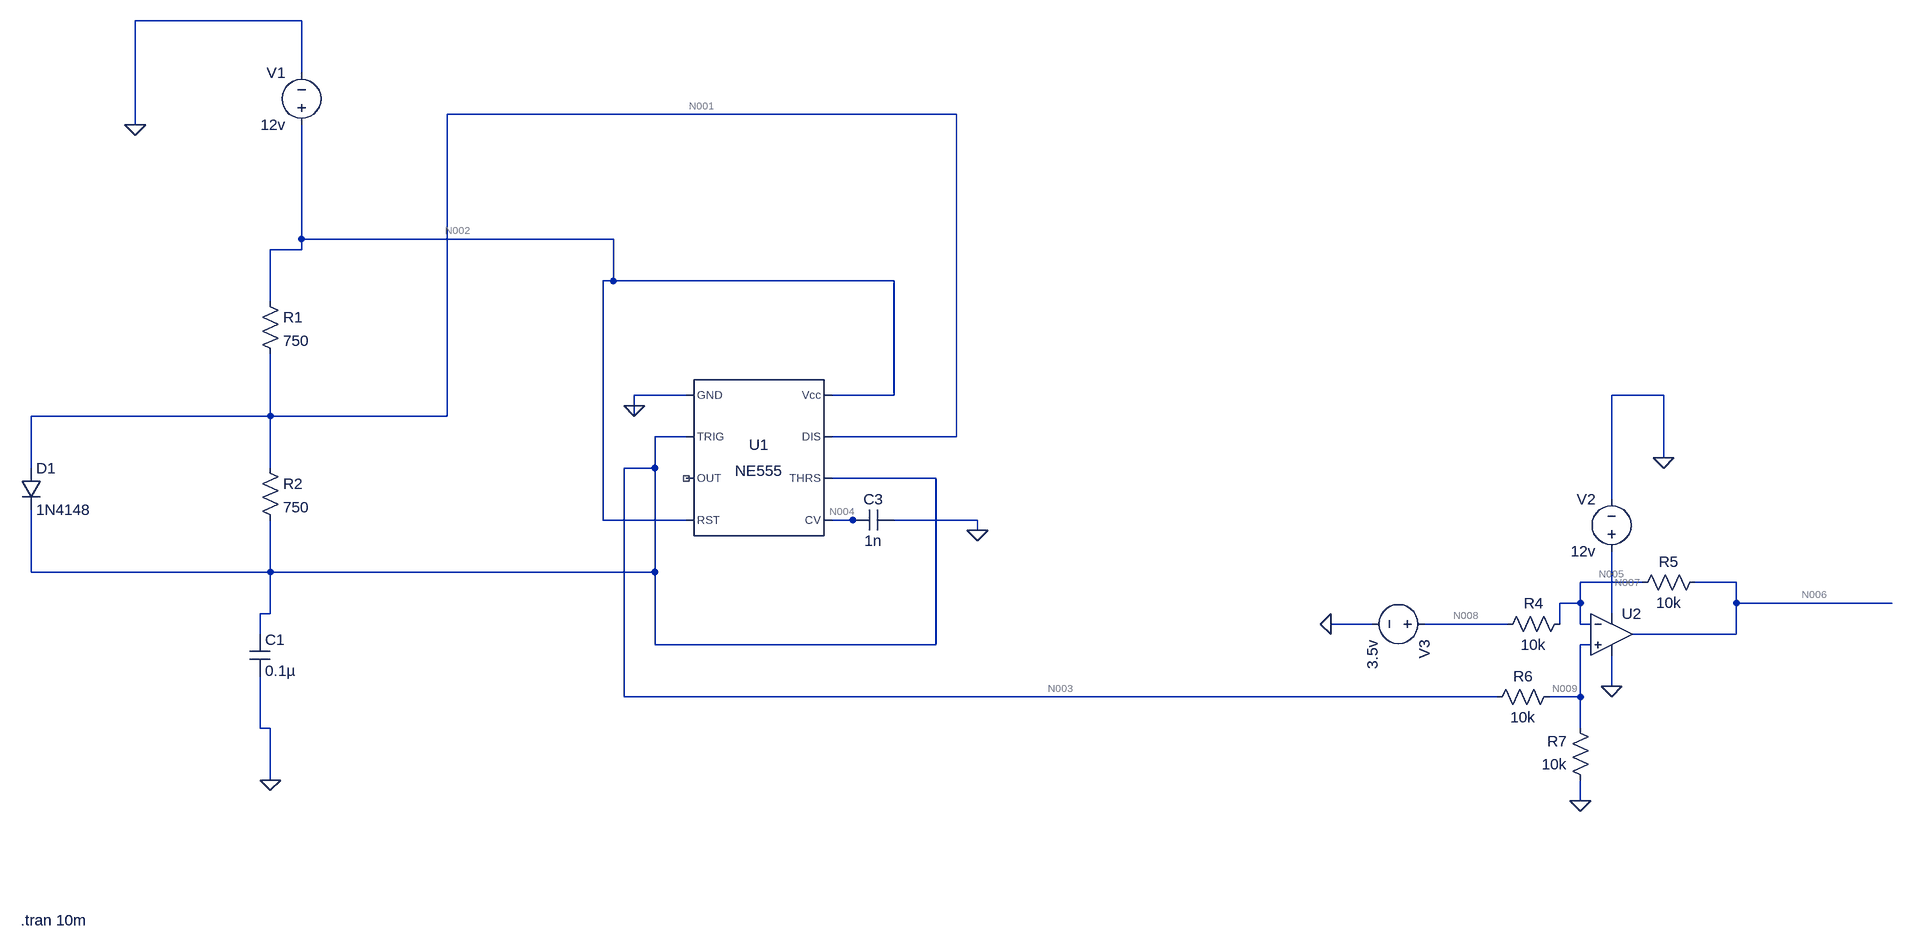
[diagram p0: schematic üçgen dalga.asc]
üçgen dalga.asc, the LTspice schematic file:
Version 4.1
SHEET 1 1748 792
WIRE -704 -608 -960 -608
WIRE -704 -528 -704 -608
WIRE 304 -464 -480 -464
WIRE -960 -448 -960 -608
WIRE -704 -272 -704 -448
WIRE -224 -272 -704 -272
WIRE -704 -256 -704 -272
WIRE -704 -256 -752 -256
WIRE -224 -208 -224 -272
WIRE -224 -208 -240 -208
WIRE 208 -208 -224 -208
WIRE -752 -176 -752 -256
WIRE -112 -32 -192 -32
WIRE 208 -32 208 -208
WIRE 208 -32 112 -32
WIRE 1392 -32 1312 -32
WIRE -192 -16 -192 -32
WIRE -752 0 -752 -96
WIRE -752 0 -1120 0
WIRE -480 0 -480 -464
WIRE -480 0 -752 0
WIRE -192 0 -192 -16
WIRE -112 32 -160 32
WIRE 304 32 304 -464
WIRE 304 32 112 32
WIRE 1392 64 1392 -32
WIRE -1120 80 -1120 0
WIRE -752 80 -752 0
WIRE -160 80 -160 32
WIRE -160 80 -208 80
WIRE 272 96 112 96
WIRE 1312 128 1312 -32
WIRE -240 160 -240 -208
WIRE -112 160 -240 160
WIRE 144 160 112 160
WIRE 160 160 144 160
WIRE 336 160 208 160
WIRE 336 176 336 160
WIRE -1120 240 -1120 144
WIRE -752 240 -752 160
WIRE -752 240 -1120 240
WIRE -160 240 -160 80
WIRE -160 240 -752 240
WIRE 1360 256 1264 256
WIRE 1504 256 1440 256
WIRE 1264 288 1264 256
WIRE 1264 288 1232 288
WIRE 1504 288 1504 256
WIRE 1744 288 1504 288
WIRE -752 304 -752 240
WIRE -752 304 -768 304
WIRE 1312 304 1312 208
WIRE 944 320 880 320
WIRE 1152 320 1024 320
WIRE 1232 320 1232 288
WIRE 1264 320 1264 288
WIRE 1280 320 1264 320
WIRE -768 336 -768 304
WIRE 1504 336 1504 288
WIRE 1504 336 1344 336
WIRE -160 352 -160 240
WIRE 272 352 272 96
WIRE 272 352 -160 352
WIRE 1280 352 1264 352
WIRE 1312 416 1312 368
WIRE -208 432 -208 80
WIRE 1136 432 -208 432
WIRE 1264 432 1264 352
WIRE 1264 432 1216 432
WIRE -768 480 -768 400
WIRE -752 480 -768 480
WIRE 1264 480 1264 432
WIRE -752 560 -752 480
WIRE 1264 592 1264 560
FLAG -752 560 0
FLAG -960 -448 0
FLAG 336 176 0
FLAG -192 -16 0
FLAG 1312 416 0
FLAG 1264 592 0
FLAG 880 320 0
FLAG 1392 64 0
SYMBOL Misc\\NE555 0 64 R0
SYMATTR InstName U1
SYMBOL voltage -704 -432 R180
WINDOW 0 24 96 Left 2
WINDOW 3 24 16 Left 2
SYMATTR InstName V1
SYMATTR Value 12v
SYMBOL res -768 -192 R0
SYMATTR InstName R1
SYMATTR Value 750
SYMBOL res -768 64 R0
SYMATTR InstName R2
SYMATTR Value 750
SYMBOL diode -1136 80 R0
SYMATTR InstName D1
SYMATTR Value 1N4148
SYMBOL cap -784 336 R0
SYMATTR InstName C1
SYMATTR Value 0.1µ
SYMBOL cap 208 144 R90
WINDOW 0 0 32 VBottom 2
WINDOW 3 32 32 VTop 2
SYMATTR InstName C3
SYMATTR Value 1n
SYMBOL OpAmps\\UniversalOpAmp2 1312 336 R0
SYMATTR InstName U2
SYMBOL voltage 1312 224 R180
WINDOW 0 24 96 Left 2
WINDOW 3 24 16 Left 2
SYMATTR InstName V2
SYMATTR Value 12v
SYMBOL res 1248 304 R90
WINDOW 0 0 56 VBottom 2
WINDOW 3 32 56 VTop 2
SYMATTR InstName R4
SYMATTR Value 10k
SYMBOL res 1456 240 R90
WINDOW 0 0 56 VBottom 2
WINDOW 3 32 56 VTop 2
SYMATTR InstName R5
SYMATTR Value 10k
SYMBOL res 1232 416 R90
WINDOW 0 0 56 VBottom 2
WINDOW 3 32 56 VTop 2
SYMATTR InstName R6
SYMATTR Value 10k
SYMBOL res 1280 576 R180
WINDOW 0 36 76 Left 2
WINDOW 3 36 40 Left 2
SYMATTR InstName R7
SYMATTR Value 10k
SYMBOL voltage 1040 320 R90
WINDOW 123 0 0 Left 0
WINDOW 39 0 0 Left 0
SYMATTR InstName V3
SYMATTR Value 3.5v
TEXT -1136 776 Left 2 !.tran 10m

The netlist it stands for:
* üçgen dalga.asc
X§U1 0 N003 NC_01 N002 N004 N003 N001 N002 NE555  ; pins GND TRIG OUT RST CV THRS DIS Vcc
V1 N002 0 12v
R1 N002 N001 750
R2 N001 N003 750
D1 N001 N003 1N4148
C1 N003 0 0.1µ
C3 0 N004 1n
X§U2 N009 N005 N007 0 N006 level2 Avol=1Meg GBW=10Meg Slew=10Meg Ilimit=25m Rail=0 Vos=0 En=0 Enk=0 In=0 Ink=0 Rin=500Meg  ; pins In+ In- V+ V- OUT
V2 N007 0 12v
R4 N005 N008 10k
R5 N006 N005 10k
R6 N009 N003 10k
R7 0 N009 10k
V3 N008 0 3.5v
.model D D
.lib standard.dio
.tran 10m
.lib NE555.sub
.lib UniversalOpAmp2.lib
.backanno
.end

* Results of the author's LTspice run, read from the files saved beside the schematic
* Operating Point, zero values left out:
*   V(n001) = 11.58 V
*   V(n002) = 12 V
*   V(n003) = 11.18 V
*   V(n004) = 8 V
*   V(n005) = 5.588 V
*   V(n006) = 7.676 V
*   V(n007) = 12 V
*   V(n008) = 3.5 V
*   V(n009) = 5.588 V
*   I(D1) = 19.09 µA
*   I(R1) = 558.8 µA
*   I(R2) = 539.7 µA
*   I(R4) = 208.8 µA
*   I(R5) = 208.8 µA
*   I(R6) = -558.8 µA
*   I(R7) = -558.8 µA
*   I(V1) = -4.44 mA
*   I(V2) = -689.8 µA
*   I(V3) = 208.8 µA
*   Ix(u1:1) = -3.881 mA
*   Ix(u1:2) = 11.18 nA
*   Ix(u1:4) = 69.33 µA
*   Ix(u1:6) = 11.18 nA
*   Ix(u1:7) = 15.45 nA
*   Ix(u1:8) = 3.812 mA
*   Ix(u2:1) = -823.9 pA
*   Ix(u2:2) = -823.9 pA
*   Ix(u2:3) = 689.8 µA
*   Ix(u2:4) = -481 µA
*   Ix(u2:5) = -208.8 µA
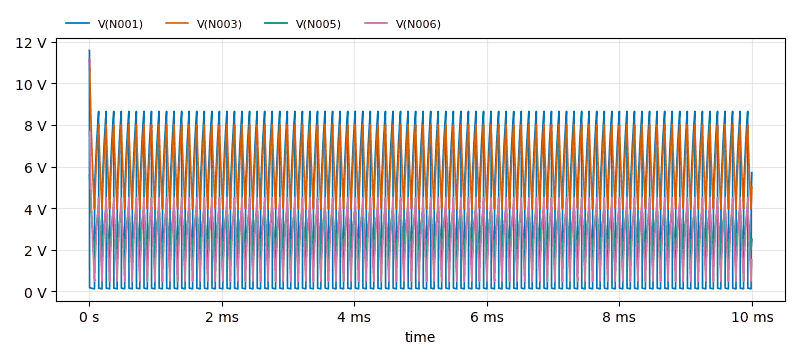
[diagram p1: Transient Analysis of üçgen dalga.asc, plotted from the saved traces]
* Transient Analysis, 1 run:
*   V(N001): min 125.9 mV, max 11.58 V, average 3.843 V, rms 5.194 V, last 5.707 V
*   V(N003): min 3.994 V, max 11.18 V, average 6.054 V, rms 6.175 V, last 5.027 V
*   V(N005): min 1.998 V, max 5.588 V, average 3.027 V, rms 3.088 V, last 2.512 V
*   V(N006): min 495.3 mV, max 7.676 V, average 2.554 V, rms 2.829 V, last 1.525 V